# EAGLE design PanelDue (EAGLE 7.2.0)
PanelDue 1.1
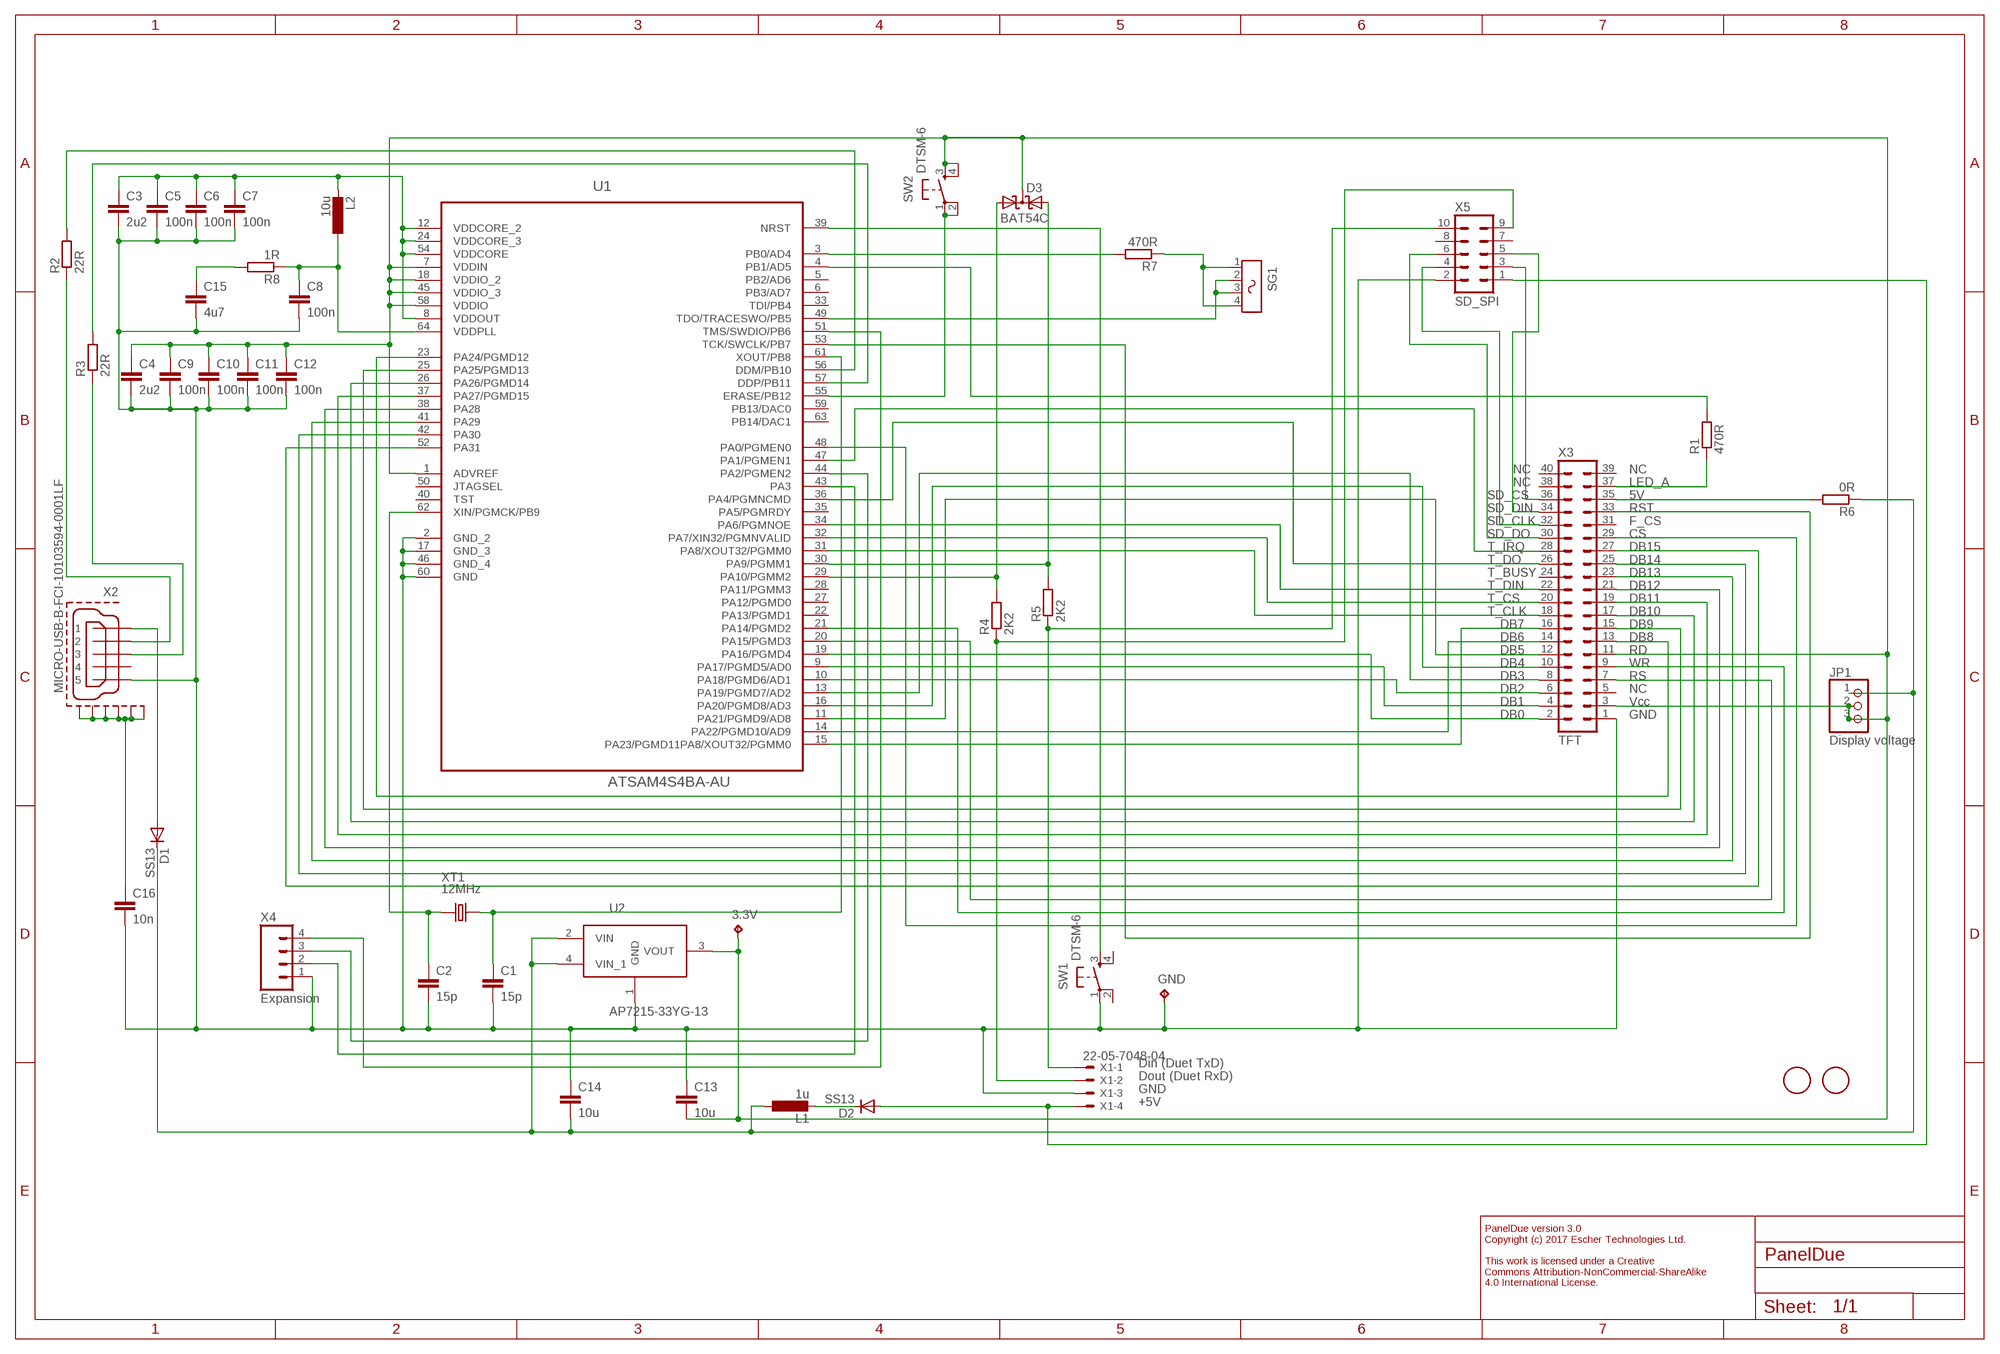
[diagram p0: schematic, sheet 1]

## Parts
3.3V  TPPAD1-10  [P1-10]
C1  15p  C-EUC0603  [C0603]
C2  15p  C-EUC0603  [C0603]
C3  2u2  C-EUC0603  [C0603]
C4  2u2  C-EUC0603  [C0603]
C5  100n  C-EUC0603  [C0603]
C6  100n  C-EUC0603  [C0603]
C7  100n  C-EUC0603  [C0603]
C8  100n  C-EUC0603  [C0603]
C9  100n  C-EUC0603  [C0603]
C10  100n  C-EUC0603  [C0603]
C11  100n  C-EUC0603  [C0603]
C12  100n  C-EUC0603  [C0603]
C13  10u  C-EUC0805  [C0805]
C14  10u  C-EUC0805  [C0805]
C15  4u7  C-EUC0603  [C0603]
C16  10n  C-EUC0603  [C0603]
D1  SS13  DIODE-DO214AC  [DO214AC]
D2  SS13  DIODE-DO214AC  [DO214AC]
D3  BAT54C  [SOT23]
GND  TPPAD1-10  [P1-10]
JP1  Display voltage  PINHD-1X3  [1X03]
L1  1u  L-EUL2012C  [L2012C]
L2  10u  L-EUL2012C  [L2012C]
R1  470R  R-EU_R0603  [R0603]
R2  22R  R-EU_R0603  [R0603]
R3  22R  R-EU_R0603  [R0603]
R4  2K2  R-EU_R0603  [R0603]
R5  2K2  R-EU_R0603  [R0603]
R6  0R  R-EU_R0603  [R0603]
R7  470R  R-EU_R0603  [R0603]
R8  1R  R-EU_R0603  [R0603]
SG1  F/QMX2  [F?QMX2]
SW1  DTSM-6  [DTSM-6]
SW2  DTSM-6  [DTSM-6]
U1  ATSAM4S4BA-AU  ATSAM3S2BA-AU  [QFP50P1200X1200X160-64N]
U2  AP7215-33YG-13  MCP17-MCP1702T-3302E/MB  [SOT150P400X160-4N]
U$1  FIDUCIAL  [FIDUCIAL_1MM]
U$2  FIDUCIAL  [FIDUCIAL_1MM]
X1  22-05-7048-04  [7395-04]
X2  MICRO-USB-B-FCI-10103594-0001LF  [10103594-0001LF]
X3  TFT  MA20-2  [MA20-2]
X4  Expansion  M04PTH  [1X04]
X5  SD_SPI  ML10L  [ML10L]
XT1  12MHz  CRYSTAL-SMD-2PIN-5X3.2  [CRYSTAL-SMD-2PIN-5X3.2]

## Nets
GND: C1.2 C2.2 C3.2 C4.2 C5.2 C6.2 C7.2 C8.2 C9.2 C10.2 C11.2 C12.2 C13.1 C14.1 C15.2 C16.2 GND.TP SW1.1 U1.2(GND_2) U1.17(GND_3) U1.46(GND_4) U1.60(GND) U2.1(GND) X1.3 X2.5 X3.1 X4.1 X5.2
N$1: U1.19(PA16/PGMD4) X3.2
N$2: U1.31(PA8/XOUT32/PGMM0) X3.18
N$3: U1.9(PA17/PGMD5/AD0) X3.4
N$4: U1.10(PA18/PGMD6/AD1) X3.6
N$5: U1.16(PA20/PGMD8/AD3) X3.10
N$6: U1.14(PA22/PGMD10/AD9) X3.14
N$7: U1.11(PA21/PGMD9/AD8) X3.12
N$8: U1.15(PA23/PGMD11PA8/XOUT32/PGMM0) X3.16
N$9: U1.23(PA24/PGMD12) X3.13
N$10: U1.13(PA19/PGMD7/AD2) X3.8
N$11: U1.25(PA25/PGMD13) X3.15
N$12: U1.26(PA26/PGMD14) X3.17
N$13: U1.37(PA27/PGMD15) X3.19
N$14: U1.38(PA28) X3.21
N$15: U1.41(PA29) X3.23
N$16: U1.42(PA30) X3.25
N$17: U1.52(PA31) X3.27
N$18: R2.2 U1.56(DDM/PB10)
N$19: U1.34(PA6/PGMNOE) X3.22
N$20: U1.36(PA4/PGMNCMD) X3.26
N$21: C1.1 U1.61(XOUT/PB8) XT1.P$2
N$22: C2.1 U1.62(XIN/PGMCK/PB9) XT1.P$1
N$23: SW2.1 SW2.2 U1.55(ERASE/PB12)
N$24: C8.1 L2.1 R8.1 U1.64(VDDPLL)
N$25: SW1.3 U1.39(NRST)
N$26: D3.2(A2) R5.2 U1.30(PA9/PGMM1)
N$27: D3.1(A1) R4.2 U1.29(PA10/PGMM2)
N$28: R3.2 U1.57(DDP/PB11)
N$29: R4.1 X1.2 X5.9
N$30: R5.1 X1.1 X5.10
N$31: D1.A X2.1
N$32: R2.1 X2.2
N$33: R7.2 U1.3(PB0/AD4)
N$34: R3.1 X2.3
N$35: U1.32(PA7/XIN32/PGMNVALID) X3.20
N$36: U1.47(PA1/PGMEN1) X3.28
N$38: R1.1 X3.37
N$39: X3.36 X5.3
N$40: R7.1 SG1.1 SG1.4
N$41: U1.43(PA3) X4.2
N$42: U1.44(PA2/PGMEN2) X4.3
N$43: U1.53(TCK/SWCLK/PB7) X3.33
N$44: U1.48(PA0/PGMEN0) X3.29
N$45: U1.21(PA14/PGMD2) X3.9
N$46: D2.C L1.2
N$47: C16.1 X2.GND1 X2.GND2 X2.GND3 X2.GND4 X2.GND5 X2.GND6
N$48: U1.20(PA15/PGMD3) X3.7
N$49: C15.1 R8.2
N$50: D2.A X1.4 X5.1
N$51: X3.34 X5.5
N$52: R1.2 U1.4(PB1/AD5)
N$53: U1.51(TMS/SWDIO/PB6) X4.4
N$54: SG1.2 SG1.3 U1.49(TDO/TRACESWO/PB5)
N$55: C3.1 C5.1 C6.1 C7.1 L2.2 U1.8(VDDOUT) U1.12(VDDCORE_2) U1.24(VDDCORE_3) U1.54(VDDCORE)
N$56: X3.32 X5.4
N$57: X3.30 X5.6
N$58: R6.2 X3.35
VCC: 3.3V.TP C4.1 C9.1 C10.1 C11.1 C12.1 C13.2 D3.3(CC) JP1.2 JP1.3 SW2.3 SW2.4 U1.1(ADVREF) U1.7(VDDIN) U1.18(VDDIO_2) U1.45(VDDIO_3) U1.58(VDDIO) U2.3(VOUT) X3.3 X3.11
VCC5: C14.2 D1.C JP1.1 L1.1 R6.1 U2.2(VIN) U2.4(VIN_1)
Unconnected: SW1.2 SW1.4 U1.5(PB2/AD6) U1.6(PB3/AD7) U1.22(PA13/PGMD1) U1.27(PA12/PGMD0) U1.28(PA11/PGMM3) U1.33(TDI/PB4) U1.35(PA5/PGMRDY) U1.40(TST) U1.50(JTAGSEL) U1.59(PB13/DAC0) U1.63(PB14/DAC1) X2.4 X3.5 X3.24 X3.31 X3.38 X3.39 X3.40 X5.7 X5.8

## Notes on the sheet
- NC | NC
- NC | LED_A
- SD_CS | 5V
- SD_DIN | RST
- SD_CLK | F_CS
- SD_DO | CS
- T_IRQ | DB15
- T_DO | DB14
- T_BUSY | DB13
- T_DIN | DB12
- T_CS | DB11
- T_CLK | DB10
- DB7 | DB9
- DB6 | DB8
- DB5 | RD
- DB4 | WR
- DB3 | RS
- DB2 | NC
- DB1 | Vcc
- DB0 | GND
- Din (Duet TxD)
- Dout (Duet RxD)
- GND
- +5V
- PanelDue version 3.0
  Copyright (c) 2017 Escher Technologies Ltd.
  
  This work is licensed under a Creative
  Commons Attribution-NonCommercial-ShareAlike
  4.0 International License.

## Library data of the parts
3.3V GND = testpad:TP: Test pad
C1-C16 = resistor:C-EU: CAPACITOR, European symbol
D1 D2 = diode:DIODE-: DIODE
D3 = diode:BAT54C: Schottky Diodes Source: Fairchild .. BAT54.pdf
JP1 = adafruit:PINHD-1X3: PIN HEADER
L1 L2 = resistor:L-EU: INDUCTOR, European symbol
R1-R8 = resistor:R-EU_: RESISTOR, European symbol
SG1 = buzzer-etl:F/QMX2
SW1 SW2 = switch-tact:DTSM-6
U1 = Atmel_By_element14_Batch_1-00:ATSAM3S2BA-AU: Flash MCU; DESCRIPTION: Flash MCU; MPN: ATSAM3S2BA-AU; OC_FARNELL: 1841653; OC_NEWARK: 12T1311; PACKAGE: QFP-64; SUPPLIER: Atmel
U2 = Microchip-MCP170xxxx_MB:MCP17: Low Quiescent Current LDO Regulator; MPN: MCP1702T-3302E/MB; OC_FARNELL: 1605558; OC_NEWARK: 11N7989; PACKAGE: SOT89-3; SUPPLIER: Microchip
U$1 U$2 = adafruit:FIDUCIAL: For use by pick and place machines to calibrate the vision/machine, 1mm By microbuilder.eu
X1 = con-molex:22-?-04: CONNECTOR wire to board 2.54 mm (.1 inch) pitch header; OC_FARNELL: unknown; OC_NEWARK: unknown
X2 = eschertechnologies:MICRO-USB-B-FCI-10103594-0001LF
X3 = con-lstb:MA20-2: PIN HEADER; OC_FARNELL: unknown; OC_NEWARK: unknown
X4 = SparkFun-Connectors:M04: Header 4 Standard 4-pin 0.1" header. Use with straight break away headers (SKU : PRT-00116), right angle break away headers (PRT-00553), swiss pins (PRT-00743), machine pins (PRT-00117), and female headers (PRT-00115). Molex polarized connector foot print use with SKU : PRT-08231 with associated crimp pins and housings. 1MM SMD Version SKU: PRT-10208
X5 = con-ml:ML10L: HARTING; OC_FARNELL: unknown; OC_NEWARK: unknown
XT1 = eschertechnologies:CRYSTAL-SMD-2PIN-5X3.2

## Board
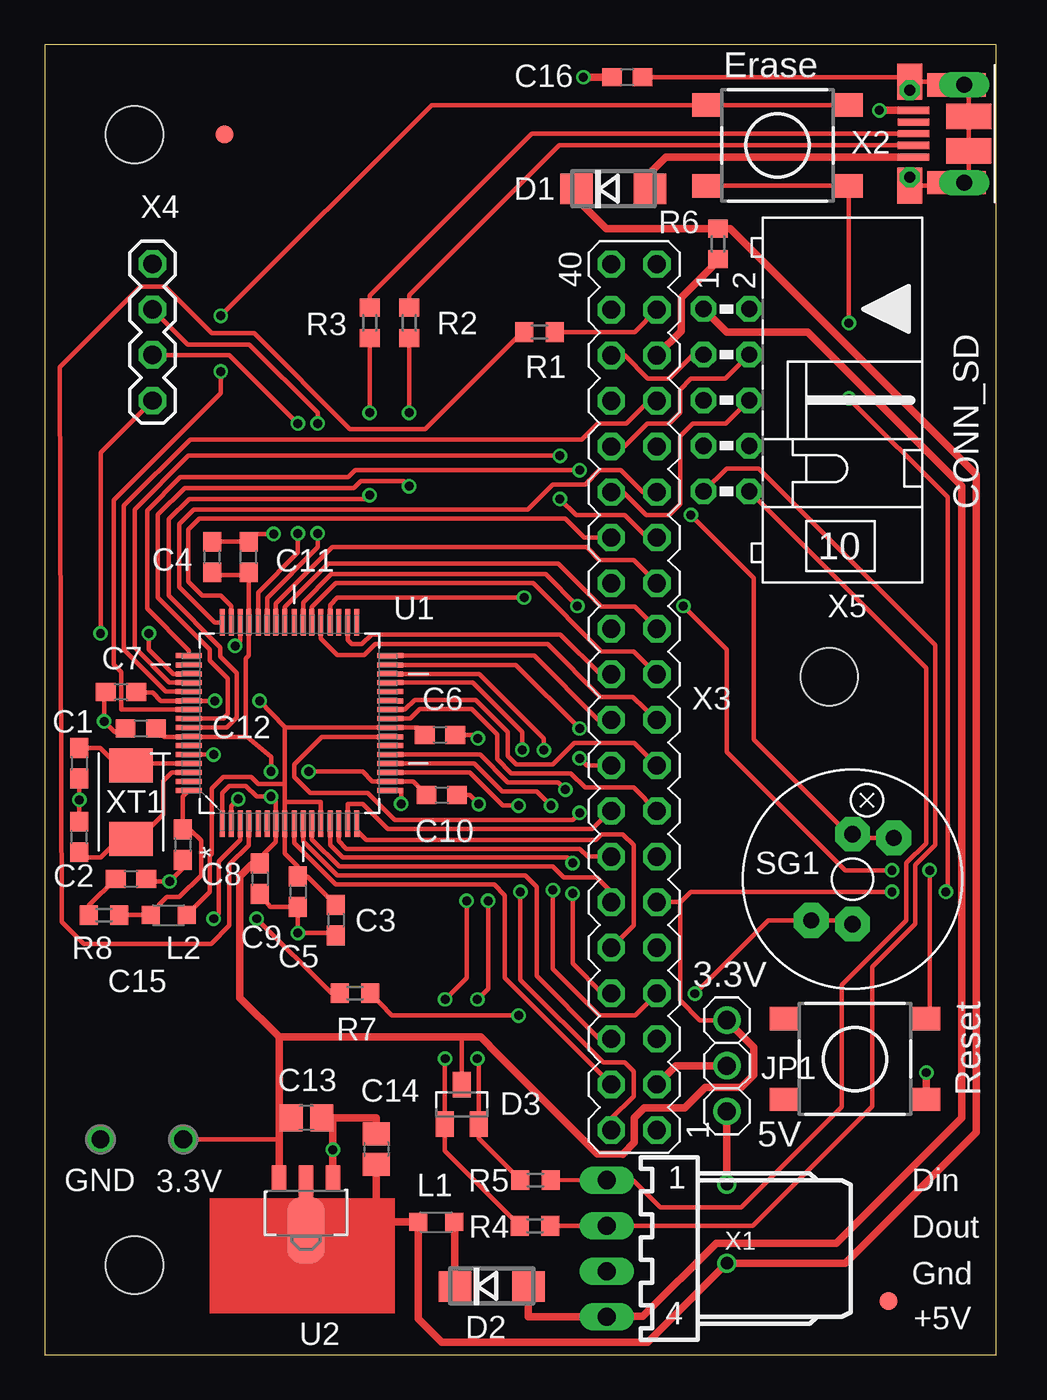
[diagram p1: board, top side]
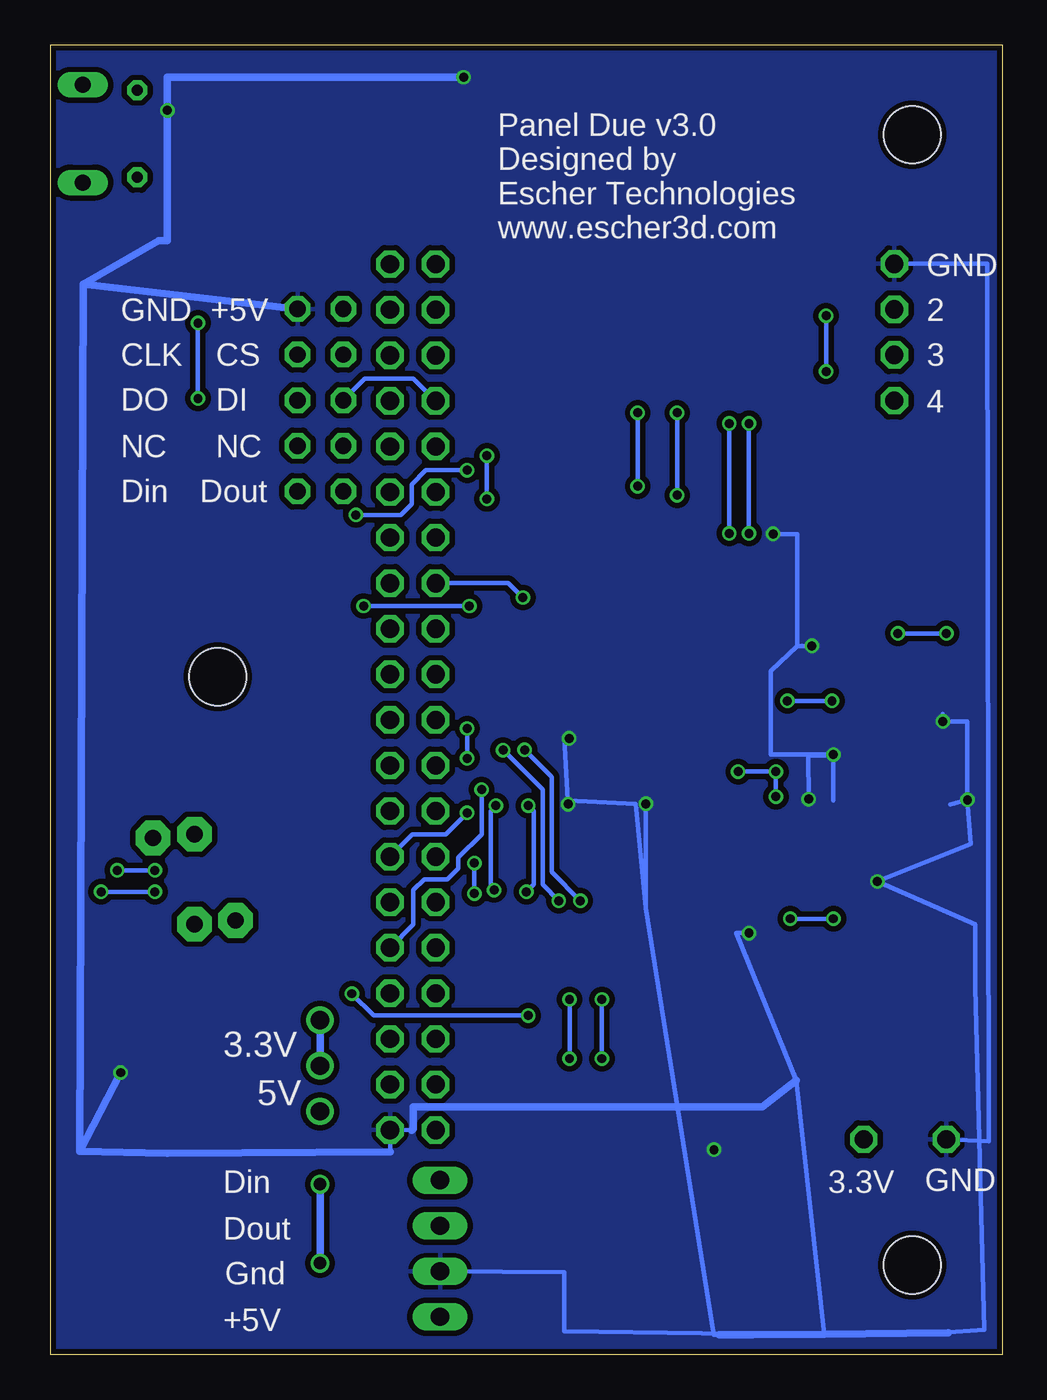
[diagram p2: board, bottom side, seen from below]

Size 53 x 73 mm. Coordinates in mm from the lower left corner, seen from the top.
Outline: 0,0 53,0 53,73 0,73 0,0
Copper layers (1*16): Top 0.035mm / dielectric 1.5mm / Bottom 0.035mm
Design rules "ITEADstudio_DRC *": minimum track width 6mil, minimum drill 12mil, track to track 6mil, track to pad 6mil, pad to pad 6mil, via to via 6mil, smd to smd 0mil, copper to edge 10mil, drill to drill 10mil, minimum pad ring 10mil, minimum via ring 6mil, stop-mask expansion 2mil, vias tented up to drill 100mil, thermal gap 10mil
Holes 3.2 mm at 43.7,37.79 5,5 5,68

### Footprints (pad centres in the part's own frame; a part is rotated, then mirrored left to right if it is on the bottom)
P1-10 = drill 1 pad 1.422 octagon: TP 0,0
C0603 = smd 1.1 x 1: 1 -0.85,0; 2 0.85,0
C0805 = smd 1.3 x 1.5: 1 -0.85,0; 2 0.85,0
DO214AC = smd 1.8 x 1.7: A 2.05,0; C -2.05,0
SOT23 = smd 1 x 1.4: 1 -0.95,-1.1; 2 0.95,-1.1; 3 0,1.1
1X03 = drill 1.016: 1 -2.54,0; 2 0,0; 3 2.54,0
L2012C = smd 1 x 1: 1 -1,0; 2 1,0
R0603 = smd 1 x 1.1: 1 -0.85,0; 2 0.85,0
F?QMX2 = drill 0.914 pad 1.93 octagon: 1 -3.25,0; 2 3.25,0; 3 1.768,1.768; 4 -1.768,-1.768
DTSM-6 = smd 1.55 x 1.3: 1 -3.975,2.25; 2 3.975,2.25; 3 -3.975,-2.25; 4 3.975,-2.25
QFP50P1200X1200X160-64N = smd 1.473 x 0.279: 1 -5.613,3.759; 2 -5.613,3.251; 3 -5.613,2.743; 4 -5.613,2.261; 5 -5.613,1.753; 6 -5.613,1.245; 7 -5.613,0.762; 8 -5.613,0.254; 9 -5.613,-0.254; 10 -5.613,-0.762; 11 -5.613,-1.245; 12 -5.613,-1.753; 13 -5.613,-2.261; 14 -5.613,-2.743; 15 -5.613,-3.251; 16 -5.613,-3.759; 33 5.613,-3.759; 34 5.613,-3.251; 35 5.613,-2.743; 36 5.613,-2.261; 37 5.613,-1.753; 38 5.613,-1.245; 39 5.613,-0.762; 40 5.613,-0.254; 41 5.613,0.254; 42 5.613,0.762; 43 5.613,1.245; 44 5.613,1.753; 45 5.613,2.261; 46 5.613,2.743; 47 5.613,3.251; 48 5.613,3.759 | smd 0.279 x 1.473: 17 -3.759,-5.613; 18 -3.251,-5.613; 19 -2.743,-5.613; 20 -2.261,-5.613; 21 -1.753,-5.613; 22 -1.245,-5.613; 23 -0.762,-5.613; 24 -0.254,-5.613; 25 0.254,-5.613; 26 0.762,-5.613; 27 1.245,-5.613; 28 1.753,-5.613; 29 2.261,-5.613; 30 2.743,-5.613; 31 3.251,-5.613; 32 3.759,-5.613; 49 3.759,5.613; 50 3.251,5.613; 51 2.743,5.613; 52 2.261,5.613; 53 1.753,5.613; 54 1.245,5.613; 55 0.762,5.613; 56 0.254,5.613; 57 -0.254,5.613; 58 -0.762,5.613; 59 -1.245,5.613; 60 -1.753,5.613; 61 -2.261,5.613; 62 -2.743,5.613; 63 -3.251,5.613; 64 -3.759,5.613
SOT150P400X160-4N = smd 0.8 x 1.4: 1 -1.499,-1.981; 3 1.499,-1.981 | smd 0.8 x 1.9: 2 0,-1.727 | smd 2.032 x 3.65: 4 0,0.94
FIDUCIAL_1MM = smd 1 x 1: 1 0,0
7395-04 = drill 1.016 long: 1 3.81,0; 2 1.27,0; 3 -1.27,0; 4 -3.81,0
10103594-0001LF = smd 0.4 x 1.75: 1 -1.3,2.825; 2 -0.65,2.825; 3 0,2.825; 4 0.65,2.825; 5 1.3,2.825 | smd 2 x 1.4: GND1 -2.9,3.03; GND6 2.9,3.03 | smd 1.3 x 3.25: GND2 -2.725,0.425; GND5 2.725,0.425 | smd 1.425 x 2.5: GND3 -0.963,-0.25; GND4 0.963,-0.25 | drill 0.9 pad 1.2 long: P$1 -2.725,0; P$7 2.725,0 | drill 0.6 pad 1.05 octagon: P$3 -2.425,3.03; P$11 2.425,3.03
MA20-2 = drill 1.016 octagon: 1 -24.13,-1.27; 2 -24.13,1.27; 3 -21.59,-1.27; 4 -21.59,1.27; 5 -19.05,-1.27; 6 -19.05,1.27; 7 -16.51,-1.27; 8 -16.51,1.27; 9 -13.97,-1.27; 10 -13.97,1.27; 11 -11.43,-1.27; 12 -11.43,1.27; 13 -8.89,-1.27; 14 -8.89,1.27; 15 -6.35,-1.27; 16 -6.35,1.27; 17 -3.81,-1.27; 18 -3.81,1.27; 19 -1.27,-1.27; 20 -1.27,1.27; 21 1.27,-1.27; 22 1.27,1.27; 23 3.81,-1.27; 24 3.81,1.27; 25 6.35,-1.27; 26 6.35,1.27; 27 8.89,-1.27; 28 8.89,1.27; 29 11.43,-1.27; 30 11.43,1.27; 31 13.97,-1.27; 32 13.97,1.27; 33 16.51,-1.27; 34 16.51,1.27; 35 19.05,-1.27; 36 19.05,1.27; 37 21.59,-1.27; 38 21.59,1.27; 39 24.13,-1.27; 40 24.13,1.27
1X04 = drill 1.016 octagon: 1 0,0; 2 2.54,0; 3 5.08,0; 4 7.62,0
ML10L = drill 0.914 octagon: 1 -5.08,-1.27; 2 -5.08,1.27; 3 -2.54,-1.27; 4 -2.54,1.27; 5 0,-1.27; 6 0,1.27; 7 2.54,-1.27; 8 2.54,1.27; 9 5.08,-1.27; 10 5.08,1.27
CRYSTAL-SMD-2PIN-5X3.2 = smd 1.9 x 2.4: P$1 -2.05,0; P$2 2.05,0

### Placement (x,y rotation side)
3.3V  7.7,12 0 top
C1  1.91,32.96 270 top
C2  1.92,28.86 90 top
C3  16.21,24.22 270 top
C4  9.34,44.46 90 top
C5  14.1,25.81 270 top
C6  22.02,34.55 0 top
C7  4.24,36.94 180 top
C8  7.68,28.42 270 top
C9  11.98,26.54 270 top
C10  22.12,31.19 0 top
C11  11.36,44.46 90 top
C12  5.34,34.9 180 top
C13  14.58,13.2 180 top
C14  18.46,11.46 270 top
C15  4.8,26.52 0 top
C16  32.45,71.2 180 top
D1  31.68,64.97 0 top
D2  24.9,3.8 0 top
D3  23.23,13.95 0 top
GND  3.1,12 0 top
JP1  38,16.1 90 top
L1  21.8,7.4 0 top
L2  6.9,24.5 0 top
R1  27.57,56.99 180 top
R2  20.3,57.5 270 top
R3  18.09,57.52 270 top
R4  27.3,7.18 180 top
R5  27.34,9.73 180 top
R6  37.5,61.9 270 top
R7  17.27,20.16 180 top
R8  3.3,24.5 180 top
SG1  45,26.5 45 top
SW1  45.14,16.48 180 top
SW2  40.82,67.4 0 top
U1  13.63,35.2 90 top
U2  14.55,7.88 180 top
U$1  10,68 0 top
U$2  47,3 0 top
X1  31.31,5.92 90 top
X2  51.22,68.05 90 top
X3  32.83,36.65 90 top
X4  6,60.8 270 top
X5  37.98,53.2 270 top
XT1  4.8,30.8 90 top

### Tracks (layer width: path | path; a pad name or v marks a point on that pad's centre or on a via)
GND  (via drill 0.5, 0.5 pad 0.25)
  Top 0.254: U1.2 10.38,29.65 10.38,30.57 10.4,30.6 v10.78,30.96 | U1.46 10.89,39.79 v10.6,39.5 | U1.60 v9.4,33.45 | C11.2 11.36,45.05 | v12.75,45.75 11.2,45.75 11.2,45.2 11.4,45.2 11.4,45.3 11.39,45.31 C11.2 | C9.2 12.56,24.96 C5.2 v14.1,23.5 16.08,23.5 C3.2 | C12.2 3.9,34.7 v3.3,35.3 3.3,36.74 C7.2 | v24.18,30.69 23.68,31.19 C10.2 | v19.85,30.7 19.85,31.44 U1.17 | C4.2 C11.2 | C6.2 23.93,34.55 v24.12,34.35 | C1.2 1.93,32.11 v1.93,30.93 1.93,29.41 C2.2 | C8.2 7.68,27.11 v6.95,26.38 5.65,26.38 C15.2
  Top 0.406: X2.5 v46.5,69.35 | v49.12,15.72 SW1.1 | C16.2 v30,71.2 | U2.1 v16.05,11.42 v16.05,11.43 16.05,13.2 | 16.05,13.2 C13.1 | 16.05,13.2 18.46,13.2 C14.1
  Bottom 0.254: 32.9,12.5 X3.1 34.1,11.3 | 9.4,33.4 v9.4,33.45 12.9,33.45 12.9,38.1 11.4,39.5 | 9.4,33.4 10.8,33.4 v10.78,30.96 | 11.4,39.5 v10.6,39.5 | 2.9,30.68 v1.93,30.93 | X1.3 24.38,4.6 24.38,1.3 16.72,1.2 13.9,1.12 | 9.4,30.9 9.4,33.4 | v14.1,23.5 14.8,23.5 11.46,15.3 9.9,1.12 | 3,1.23 3.35,1.23 1,1.4 1.5,20.5 1.5,23.98 v6.95,26.38 1.75,28.48 v1.93,30.93 | v19.85,30.7 19.85,24.9 | 19.85,24.9 16.05,1.12 15.75,1.12 | v24.12,34.35 24.4,34.4 24.2,30.89 | 24.2,30.89 20.4,30.7 19.85,24.9 | v24.18,30.69 24.2,30.89 | v12.75,45.75 11.4,45.75 11.4,39.5 | X4.1 0.83,60.8 0.73,11.9 GND.TP | 3.3,35.7 v3.3,35.3 1.93,35.3 v1.93,30.93
  Bottom 0.406: 32.9,12.5 32.82,12.58 32.82,13.8 13.36,13.8 11.46,15.3 | 15.75,1.12 13.9,1.12 9.9,1.12 3,1.23 | 34.1,11.3 46.52,11.22 51.4,11.32 | 51.4,11.32 v49.12,15.72 | 51.2,59.68 46.98,62.1 46.5,62.1 v46.5,69.35 46.5,71.2 v30,71.2 | 51.2,59.68 51.4,11.32 | X5.2 51.2,59.68
  pour Bottom (isolate 0.305): 0.2,72.8 52.8,72.8 52.8,0.2 0.2,0.2
N$1  (via drill 0.5)
  Top 0.254: U1.19 23.67,32.46 25.52,30.6 v26.4,30.6 | v26.5,25.8 26.5,20.9 31.1,16.3 32.3,16.3 32.8,15.8 32.8,14.4 31.56,13.16 X3.2
  Bottom 0.254: v26.4,30.6 26.1,30.3 26.1,26.2 v26.5,25.8
N$2  (via drill 0.5)
  Top 0.254: X3.18 30.2,32.84 v29.8,33.24 | U1.31 26.25,38.45 v29.8,34.9
  Bottom 0.254: v29.8,34.9 v29.8,33.24
N$3
  Top 0.254: U1.9 13.88,28.52 16.2,26.2 25.03,26.2 25.62,25.61 25.62,21 X3.4
N$4
  Top 0.254: U1.10 14.39,28.61 16.3,26.7 26.76,26.7 27.4,26.06 27.4,21.1 30.9,17.6 X3.6
N$5
  Top 0.254: U1.16 17.39,29.21 17.9,28.7 30.7,28.7 31,29 32.2,29 32.8,28.4 32.8,23.92 X3.10
N$6
  Top 0.254: U1.14 16.37,28.63 16.8,28.2 29.8,28.2 30.24,27.76 X3.14
N$7
  Top 0.254: U1.11 14.88,28.73 16.4,27.2 28.3,27.2 28.9,26.6 30.74,26.6 31.56,25.78 X3.12
N$8
  Top 0.254: U1.15 16.88,30.7 17.7,30.7 19.1,29.3 30.5,29.3 31.5,30.3 X3.16
N$9  (via drill 0.5)
  Top 0.254: U1.23 15.44,34.44 13.9,32.9 13.9,32.2 14.8,31.3 18,31.3 19.5,29.8 29.4,29.8 v29.8,30.2
  Bottom 0.254: v29.8,30.2 31,29 32.86,29 X3.13
N$10  (via drill 0.5)
  Top 0.254: X3.8 31.06,20.14 29.4,21.8 v29.4,25.7 | U1.13 15.89,28.41 16.6,27.7 29.1,27.7 v29.4,27.4
  Bottom 0.254: v29.4,27.4 v29.4,25.7
N$11
  Top 0.254: U1.25 20.35,35.45 20.9,36 23.78,36 25.2,34.58 25.2,33.19 25.99,32.4 29.3,32.4 30.1,31.6 32.8,31.6 X3.15
N$12
  Top 0.254: U1.26 20.06,35.96 20.6,36.5 24,36.5 25.8,34.7 25.8,33.36 26.26,32.9 28.3,32.9 29.5,34.1 32.84,34.1 X3.17
N$13
  Top 0.254: X3.19 32.76,36.66 30.95,36.66 28.01,39.6 18.4,39.6 17.8,39 16.3,39 15.38,39.92 U1.37
N$14
  Top 0.254: U1.38 14.88,41.67 16.2,43 27.2,43 31,39.2 32.82,39.2 X3.21
N$15
  Top 0.254: U1.41 13.38,41.68 15.8,44.1 28.6,44.1 31,41.7 32.86,41.7 X3.23
N$16
  Top 0.254: U1.42 12.87,41.87 16,45 30.2,45 30.9,44.3 32.8,44.3 X3.25
N$17  (via drill 0.5)
  Top 0.254: X3.27 33.56,45.54 32.3,46.8 29.6,46.8 v28.7,47.7 | U1.52 6.94,37.46 5,39.4 5,47.1 8,50.1 v28.7,50.1
  Bottom 0.254: v28.7,50.1 v28.7,47.7
N$18  (via drill 0.5)
  Top 0.254: U1.56 9.95,35.45 10,35.5 | 9.95,35.45 10,35.5 | 10,35.5 10.2,35.7 10.2,37.7 9.2,38.7 9.2,39.3 6.3,42.2 6.3,46.81 7.79,48.3 17.2,48.3 17.6,48.7 20,48.7 v20.3,48.4 | R2.2 20.3,55.41 v20.3,52.5
  Bottom 0.254: v20.3,48.4 v20.3,52.5
N$19
  Top 0.254: U1.34 16.88,39.82 17.1,39.6 17.65,39.6 18.2,40.15 28.73,40.15 30.98,37.92 X3.22
N$20  (via drill 0.5)
  Top 0.254: U1.36 15.89,41.79 16.3,42.2 v26.7,42.2
  Bottom 0.254: X3.26 27.5,43 v26.7,42.2
N$21
  Top 0.254: 4.8,32.94 XT1.P$2 | U1.61 4.81,32.94 XT1.P$2 | C1.1 3.09,33.81 4,32.9 4.75,32.9 XT1.P$2
N$22
  Top 0.254: U1.62 7.07,32.46 6.6,31.99 6.6,30.1 5.25,28.75 XT1.P$1 | C2.1 2.31,27.71 3.11,27.71 4.1,28.7 4.75,28.7 XT1.P$1 | 4.85,28.8 XT1.P$1 | 4.75,29 XT1.P$1
N$23  (via drill 0.5)
  Top 0.254: SW2.2 SW2.1 21.55,69.65 v9.8,57.9 | v9.8,54.8 9.8,53.6 3.83,47.62 3.83,38.48 4.25,38.05 4.25,35.96 U1.55
  Bottom 0.254: v9.8,54.8 v9.8,57.9
N$24
  Top 0.254: 7.94,31.44 U1.64 7.68,31.1 C8.1 8.08,29.27 8.7,28.65 8.7,26.7 7.5,25.5 6.8,25.5 5.9,24.6 L2.1 R8.1
N$25  (via drill 0.5)
  Top 0.254: U1.39 14.39,41.93 15.96,43.5 27.9,43.5 v29.68,41.73 | v47.2,27 44.6,27 38,33.6 38,36.15 38,36.34 38,39.3 v35.58,41.73 | v49.3,27 49.3,18.73
  Top 0.406: 49.3,18.73 SW1.3
  Bottom 0.254: v29.68,41.73 v35.58,41.73 | v47.2,27 v49.3,27
N$26  (via drill 0.5)
  Top 0.254: v24.7,25.3 24.7,20.4 v24.1,19.8 | v24.1,16.5 24.18,16.43 D3.2 24.18,12.04 R5.2 | U1.30 24.19,37.94 27.8,34.34 v27.8,33.7
  Bottom 0.254: v24.1,19.8 v24.1,16.5 | v27.8,33.7 25.6,31.5 25.6,26.2 v24.7,25.3
N$27  (via drill 0.5)
  Top 0.254: v23.5,25.3 23.5,21 v22.3,19.8 | v22.3,16.5 22.27,16.48 D3.1 22.27,11.36 R4.2 | U1.29 23.84,37.46 26.6,34.7 v26.6,33.71
  Bottom 0.254: v22.3,19.8 v22.3,16.5 | v23.5,25.3 25.1,26.9 25.1,32.21 v26.6,33.71
N$28  (via drill 0.5)
  Top 0.254: U1.57 10.15,34.95 10.7,35.5 10.7,38 9.78,38.92 9.78,39.42 6.9,42.3 6.9,46.57 8.03,47.7 17.9,47.7 v18.1,47.9 | v18.1,52.5 18.09,55.6 R3.2
  Bottom 0.254: v18.1,47.9 v18.1,52.5
N$29
  Top 0.254: R4.1 X1.2 39.44,7.18 46.1,13.85 46.1,21.6 48.5,24 48.5,27.3 49.6,28.4 49.6,39.56 39.77,49.4 37.98,49.4 X5.9
N$30
  Top 0.254: R5.1 X1.1 32.77,9.72 34.3,8.2 38.79,8.2 44.4,13.81 44.4,20.6 48,24.2 48,27.4 49.1,28.5 49.1,38.27 X5.10
N$31
  Top 0.406: X2.1 34.59,66.75 33.73,65.89 D1.A
N$32
  Top 0.254: R2.1 20.3,59.05 28.66,67.4 X2.2
N$33  (via drill 0.5)
  Top 0.254: U1.3 10.89,28.69 9.7,27.5 9.7,24.6 v9.4,24.3 | R7.2 15.95,20.16 v11.8,24.3
  Bottom 0.254: v9.4,24.3 v11.8,24.3
N$34
  Top 0.254: X2.3 27.11,68.05 18.09,59.03 R3.1
N$35
  Top 0.254: U1.32 27.27,38.96 30.84,35.38 X3.20
N$36
  Top 0.254: U1.47 10.38,41.72 9.8,42.3 8.78,42.3 8,43.08 8,46 8.6,46.6 29,46.6 30.06,45.54 X3.28
N$38
  Top 0.254: X3.37 32.86,57 R1.1
N$39
  Top 0.254: X3.36 32.3,55.7 33.6,54.4 34.8,54.4 36.1,55.7 36.66,55.7 X5.3
N$40  (via drill 0.5)
  Top 0.254: v26.4,18.9 19.34,18.9 R7.1 | v36.22,20.12 40.3,24.2 SG1.1 44.8,24.2 SG1.4
  Bottom 0.254: v36.22,20.12 35,18.9 v26.4,18.9
N$41  (via drill 0.5)
  Top 0.254: U1.43 12.38,42.19 15.2,45 v15.2,45.77 | X4.2 7.96,56.3 11.4,56.3 15.2,52.5 v15.2,51.9
  Bottom 0.254: v15.2,45.77 v15.2,51.9
N$42  (via drill 0.5)
  Top 0.254: U1.44 11.88,42.48 14.1,44.7 v14.1,45.77 | X4.3 10.28,55.72 v14.1,51.9
  Bottom 0.254: v14.1,45.77 v14.1,51.9
N$43
  Top 0.254: U1.53 6.75,36.95 4.4,39.3 4.4,47.31 8.09,51 29.9,51 30.8,51.9 32.4,51.9 33.66,53.16 X3.33
N$44
  Top 0.254: X3.29 33.32,48.08 32.1,49.3 30.9,49.3 30.1,48.5 28.3,48.5 26.9,47.1 8.3,47.1 7.5,46.3 7.5,42.78 9.47,40.81 U1.48
N$45  (via drill 0.5)
  Top 0.254: U1.21 24.25,33.45 25.79,31.9 28.6,31.9 v29,31.5
  Bottom 0.254: v29,31.5 29,29 30.3,27.7 30.3,27.1 30.9,26.5 32.2,26.5 32.8,25.9 32.8,23.98 X3.9
N$46
  Top 0.254: L1.2 22.85,7.5
  Top 0.406: 22.85,7.5 D2.C
N$47
  Top 0.254: C16.1 47.94,71.2 X2.GND6 50.62,70.95 X2.GND5 51.47,70.1 X2.GND4 X2.GND3 | 50.8,67.11 50.9,67 50.9,67.09 X2.GND3 | X2.GND1 50.62,65.15 X2.GND2 50.9,65.43 51.47,65.43 X2.GND3
N$48  (via drill 0.5)
  Top 0.254: X3.7 34.1,20.1 32.9,18.9 30.9,18.9 28.3,21.5 v28.3,25.9 | U1.20 23.94,32.94 25.48,31.4 27.4,31.4 v28.2,30.6
  Bottom 0.254: v28.3,25.9 28.5,26.1 28.5,30.3 v28.2,30.6
N$49
  Top 0.254: C15.1 2.45,25.02 R8.2
N$50
  Top 0.406: D2.A 26.95,2.1 X1.4 31.63,2.12 33.33,2.12 37.4,6.2 44.1,6.2 51.1,13.2 51.1,48.4 42.5,57 37.98,57 X5.1
N$51
  Bottom 0.254: X3.34 32.82,54.4 35.51,54.4 X5.5
N$52
  Top 0.254: U1.4 11.37,28.37 10.28,27.32 10.28,23.92 9.27,22.9 2.15,22.9 0.93,24.12 0.83,55.04 5.31,59.52 6.72,59.52 9.3,56.94 11.66,56.94 17,51.6 21.2,51.6 26.59,56.99 R1.2
N$53  (via drill 0.5)
  Top 0.254: U1.51 7.16,37.94 5.8,39.3 v5.8,40.2 | v3.1,40.2 3.1,50.28 X4.4
  Bottom 0.254: v5.8,40.2 v3.1,40.2
N$54  (via drill 0.5)
  Top 0.254: v29.8,49.3 17.3,49.3 16.9,48.9 7.54,48.9 5.7,47.06 5.7,41.58 8.02,39.26 U1.49 | SG1.2 45.2,28.8 SG1.3 44.8,29 39.5,34.3 39.5,43.3 v36,46.8
  Bottom 0.254: v29.8,49.3 32.1,49.3 32.9,48.5 32.9,47.4 33.5,46.8 v36,46.8
N$55  (via drill 0.5)
  Top 0.254: v11.96,36.44 13.35,35 13.38,34.97 13.38,34.95 | v9.47,36.44 8.04,36.44 U1.54 6.46,36.45 6,36.9 5.13,36.9 C7.1 | 13.38,30.8 U1.8 13.38,27.92 14.1,27.2 C5.1 14.62,26.66 C3.1 | 13.38,30.8 13.38,31.8 | 13.38,31.8 13.38,34.95 | 13.38,34.95 U1.24 20.77,34.95 C6.1 | U1.12 15.38,30.8 13.38,30.8 | 13.38,31.8 11.9,31.8 11.5,32.2 9.94,32.2 9.3,31.56 9.3,27.9 9.2,27.8 9.2,25.8 L2.2
  Bottom 0.254: v11.96,36.44 v9.47,36.44
N$56
  Top 0.254: X5.4 37.9,54.4 36,54.4 35.4,53.8 35.4,52.5 34.8,51.9 33.56,51.9 32.28,50.62 X3.32
N$57
  Top 0.254: X3.30 32.22,48.08 33.5,46.8 34.8,46.8 35.4,47.4 35.4,51.2 36.1,51.9 37.95,51.9 X5.6
N$58
  Top 0.406: X3.35 35.45,57.05 35.45,58.92 36.16,59.62 37.5,60.96 R6.2
VCC  (via drill 0.5)
  Top 0.254: U1.7 | C10.1 20.52,31.95 U1.18 18.71,31.95 18.25,31.95 17.7,32.5 v14.7,32.5 | 11.2,34.44 U1.58 6.65,34.44 C12.1 | 11.2,34.44 11.26,34.44 12.6,33.3 v12.6,32.5 | C4.1 9.26,43.64 9.44,43.46 11.36,43.46 C11.1 U1.45 11.37,38.97 11.2,38.8 11.2,34.44 | SW2.3 SW2.4 v44.8,57.5 | C13.2 13.2,13.2 13.05,13.2 | U1.7 12.87,30.83 v12.6,31.1 11.8,31.1 11.2,31.7 10.26,31.7 9.87,31.31 U1.1 | X3.11 35.4,25.22 | 35.4,25.22 35.4,19.74 36.5,18.64 JP1.3 | v44.8,53.3 50.3,47.8 50.3,25.8 v50.2,25.8 | 35.4,25.22 35.42,25.22 36,25.8 v47.2,25.8 | U1.7 12.87,28.57 12.2,27.9 12.2,27.4 C9.1 | D3.3 23.23,17.7 | 3.3V.TP 13.05,12 13.05,11.8
  Top 0.406: U2.3 13.05,11.8 13.05,13.2 | JP1.3 39.5,17.14 39.5,15.61 38.79,14.9 36.8,14.9 35.65,13.75 33.41,13.75 32.85,13.19 32.85,11.83 32.2,11.18 30.77,11.18 25.3,16.67 24.27,17.7 23.23,17.7 13.05,17.7 | 13.05,17.7 10.85,19.9 10.85,26.65 11.5,27.3 12.1,27.3 C9.1 | 13.2,13.2 13.05,13.2 13.05,13.5 13.05,17.7 | X3.3 35.14,16.1 JP1.2
  Bottom 0.254: v14.7,32.5 v12.6,32.5 v12.6,31.1 | v47.2,25.8 v50.2,25.8 | v44.8,53.3 v44.8,57.5
  Bottom 0.406: JP1.2 JP1.3
VCC5  (via drill 0.7)
  Top 0.254: 14.49,6.9 U2.4
  Top 0.406: U2.2 U2.4 18.4,6.94 | 14.49,6.9 18.46,6.9 18.46,7.4 | D1.C 29.62,64.4 31.27,62.75 R6.1 38.2,62.75 51.9,49.05 51.9,12.4 44.6,5.1 v38,5.1 33.6,0.7 22.1,0.7 20.8,2 L1.1 18.46,7.4 | JP1.1 v38,9.5 | C14.2 18.46,7.4
  Bottom 0.406: v38,9.5 v38,5.1
(copper drawn outside any net)
  shapes: Top area x1

### Text on the board
tNames: Erase | CONN_SD | 3.3V | Reset | 5V | Din | Dout | Gnd | +5V
bNames: Panel Due v3.0 / Designed by / Escher Technologies / www.escher3d.com | GND | 2 | +5V | GND | 3 | CS | CLK | DI | DO | 4 | NC | NC | Dout | Din | 3.3V | 5V | GND | 3.3V | Din | Dout | Gnd | +5V